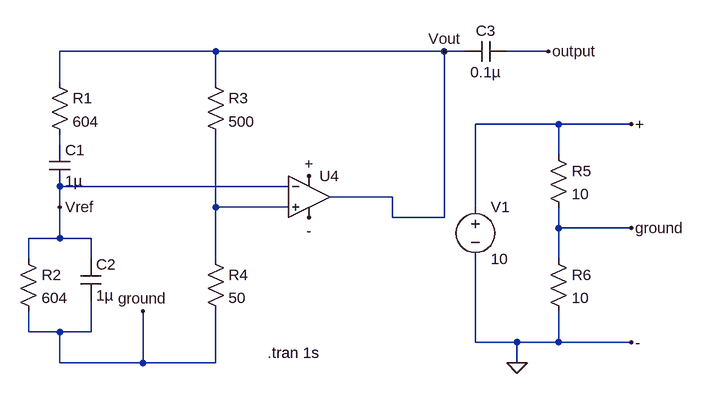
[diagram p0: schematic Sine_wave_oscilator.asc]
Sine_wave_oscilator.asc, the LTspice schematic file:
Version 4
SHEET 1 1532 712
WIRE 256 64 16 64
WIRE 608 64 256 64
WIRE 640 64 608 64
WIRE 768 64 704 64
WIRE 16 112 16 64
WIRE 256 112 256 64
WIRE 784 176 656 176
WIRE 896 176 784 176
WIRE 16 208 16 192
WIRE 784 224 784 176
WIRE 368 272 16 272
WIRE 528 288 432 288
WIRE 16 304 16 272
WIRE 256 304 256 192
WIRE 368 304 256 304
WIRE 656 304 656 176
WIRE 528 320 528 288
WIRE 608 320 608 64
WIRE 608 320 528 320
WIRE 784 336 784 304
WIRE 896 336 784 336
WIRE 16 352 16 304
WIRE 16 352 -32 352
WIRE 64 352 16 352
WIRE -32 384 -32 352
WIRE 64 384 64 352
WIRE 256 384 256 304
WIRE 784 384 784 336
WIRE -32 496 -32 464
WIRE 16 496 -32 496
WIRE 64 496 64 448
WIRE 64 496 16 496
WIRE 656 512 656 384
WIRE 720 512 656 512
WIRE 784 512 784 464
WIRE 784 512 720 512
WIRE 896 512 784 512
WIRE 16 544 16 496
WIRE 144 544 144 464
WIRE 144 544 16 544
WIRE 256 544 256 464
WIRE 256 544 144 544
WIRE 720 544 720 512
FLAG 720 544 0
FLAG 896 176 +
FLAG 400 256 +
FLAG 896 336 ground
FLAG 144 464 ground
FLAG 896 512 -
FLAG 400 320 -
FLAG 768 64 output
FLAG 608 64 Vout
FLAG 16 304 Vref
SYMBOL res 0 96 R0
SYMATTR InstName R1
SYMATTR Value 604
SYMATTR SpiceLine tol=1 pwr=0.1
SYMBOL res -48 368 R0
SYMATTR InstName R2
SYMATTR Value 604
SYMATTR SpiceLine tol=1 pwr=0.1
SYMBOL res 240 96 R0
SYMATTR InstName R3
SYMATTR Value 500
SYMATTR SpiceLine tol=1 pwr=0.1
SYMBOL res 240 368 R0
SYMATTR InstName R4
SYMATTR Value 50
SYMATTR SpiceLine tol=1 pwr=0.1
SYMBOL voltage 656 288 R0
WINDOW 123 0 0 Left 0
WINDOW 39 0 0 Left 0
SYMATTR InstName V1
SYMATTR Value 10
SYMBOL res 768 208 R0
SYMATTR InstName R5
SYMATTR Value 10
SYMATTR SpiceLine tol=1 pwr=0.1
SYMBOL res 768 368 R0
SYMATTR InstName R6
SYMATTR Value 10
SYMATTR SpiceLine tol=1 pwr=0.1
SYMBOL cap 48 384 R0
SYMATTR InstName C2
SYMATTR Value 1µ
SYMBOL cap 0 208 R0
SYMATTR InstName C1
SYMATTR Value 1µ
SYMBOL cap 704 48 R90
WINDOW 0 0 32 VBottom 2
WINDOW 3 32 32 VTop 2
SYMATTR InstName C3
SYMATTR Value 0.1µ
SYMATTR SpiceLine V=6.3 Irms=25.7m Rser=3.62516 Lser=0
SYMBOL Opamps\\UniversalOpamp2 400 288 R0
SYMATTR InstName U4
TEXT 336 528 Left 2 !.tran 1s

The netlist it stands for:
* Sine_wave_oscilator.asc
R1 Vout N001 604 tol=1 pwr=0.1
R2 Vref ground 604 tol=1 pwr=0.1
R3 Vout N002 500 tol=1 pwr=0.1
R4 N002 ground 50 tol=1 pwr=0.1
V1 + 0 10
R5 + ground 10 tol=1 pwr=0.1
R6 ground 0 10 tol=1 pwr=0.1
C2 Vref ground 1µ
C1 N001 Vref 1µ
C3 output Vout 0.1µ V=6.3 Irms=25.7m Rser=3.62516 Lser=0
XU4 N002 Vref + 0 Vout level.2 Avol=1Meg GBW=10Meg Slew=10Meg ilimit=25m rail=0 Vos=0 phimargin=45 en=0 enk=0 in=0 ink=0 Rin=500Meg  ; pins IN+ IN- V+ V- OUT
.tran 1s
.lib UniversalOpamps2.sub
.backanno
.end